# EAGLE design drandyhaas logo (EAGLE 9.6.2)
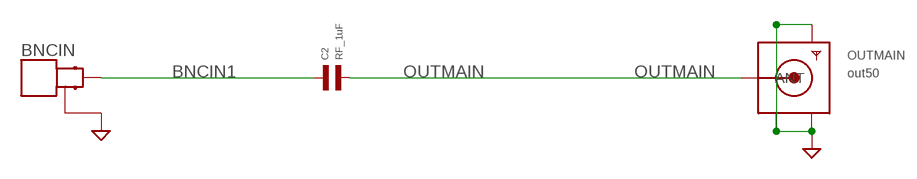
[diagram p0: schematic, sheet 1]

## Parts
BNCIN  MOLEX_BNC_73100-0105  [MOLEX-BNC-73100-0105]
C2  RF_1uF  CAPACITOR_NP_0402  [C0402]
OUTMAIN  out50  SMACONNECTOR_EDGE  [SMA_EDGELAUNCH]

## Nets
BNCIN1: BNCIN.SIGNAL C2.P$1
GND: BNCIN.GND1(GND) BNCIN.GND2(GND) OUTMAIN.GND@1(GND4) OUTMAIN.GND@2(GND3) OUTMAIN.GND@3(GND2) OUTMAIN.GND@4(GND1)
OUTMAIN: C2.P$2 OUTMAIN.P(ANT)

## Library data of the parts
BNCIN = connector:MOLEX_BNC_73100-0105: CONN BNC JACK R/A 50 OHM PCB; DIGIKEY: WM5524-ND; MPN: 73100-0105
C2 = MF_Passives:CAPACITOR_NP: Library: MF_Passives Description: Device for Non-Polarized Capacitors. Manufacture part number (MPN) can be added via Attributes. Check https://factory.macrofab.com/parts for the house parts list.; LCSC: C52923; POPULATE: 1
OUTMAIN = adafruit:SMACONNECTOR: SMA Connector 90° DIP SMA Connector, 50 Ohm (4UConnector: 07259)

## Net classes
0 default: width 0.203 mm
1 power: width 0.152 mm

## Board
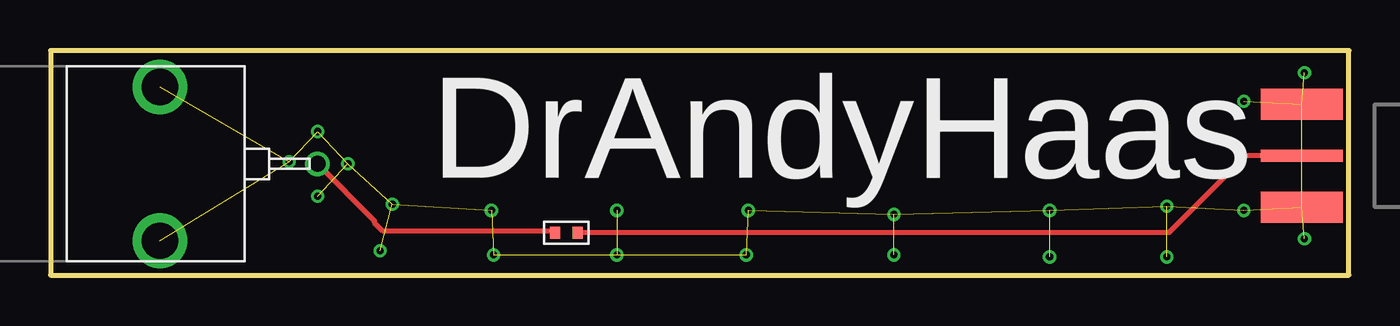
[diagram p1: board, top side]
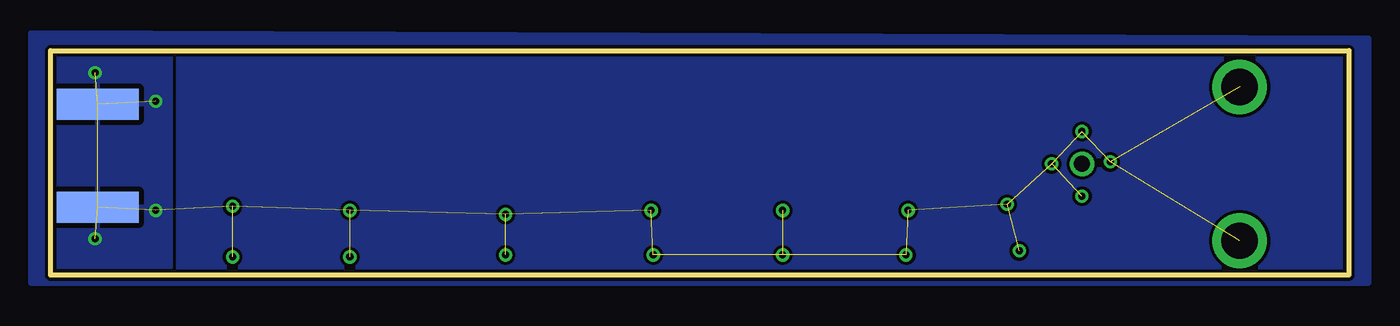
[diagram p2: board, bottom side, seen from below]

Size 64.2 x 11.1 mm. Coordinates in mm from the lower left corner, seen from the top.
Outline: 0,11.1 0,0 64.2,0 64.2,11.1 0,11.1
Copper layers (1*2*15*16): top 0.035mm / dielectric 0.2mm / topgnd 0.0175mm / dielectric 0.3mm / vsmin 0.0175mm / dielectric 0.2mm / vsplus 0.035mm
Design rules "Seeed_AllPCB_MacroFab_haas6mil *": minimum track width 6mil, minimum drill 12mil, track to track 6mil, track to pad 6mil, pad to pad 6mil, via to via 6mil, smd to smd 0mil, copper to edge 6mil, drill to drill 6mil, minimum pad ring 6mil, minimum via ring 6mil, stop-mask expansion 6mil, vias tented up to drill 25mil, thermal gap 10mil

### Footprints (pad centres in the part's own frame; a part is rotated, then mirrored left to right if it is on the bottom)
MOLEX-BNC-73100-0105 = drill 1.8: GND1 -3.8,-3.9; GND2 3.8,-3.9 | drill 0.8: SIGNAL 0,3.9
C0402 = smd 0.5 x 0.6: P$1 -0.55,0; P$2 0.55,0
SMA_EDGELAUNCH = smd 4.064 x 1.524: GND@1 2.032,-2.54; GND@2 2.032,2.54 | smd 4.064 x 1.524 bottom: GND@3 2.032,2.54; GND@4 2.032,-2.54 | smd 4.064 x 0.6: P 2.032,0

### Placement (x,y rotation side)
BNCIN  9.3,5.5 270 top
C2  25.5,2.1 0 top
OUTMAIN  63.9,5.9 180 top

### Tracks (layer width: path | path; a pad name or v marks a point on that pad's centre or on a via)
BNCIN1
  top 0.254: BNCIN.SIGNAL 16,2.7 16,2.6 16.4,2.2 24.85,2.2 C2.P$1
GND  (via drill 0.35)  (27 unrouted)
  other vias: 59,3.2 62,1.8 59,8.6 62,10 11.8,5.6 13.2,7.1 21.9,1 16.3,1.2 13.2,3.9 55.2,3.4 16.9,3.5 55.2,0.9 49.4,0.9 14.7,5.5 49.4,3.2 41.7,1 28,1 21.8,3.2 28,3.2 34.5,3.2 34.4,1 41.7,3
  pour vsplus: 64.6,11.6 64.6,0.4 58.2,0.4 58.2,11.6
OUTMAIN
  top 0.254: OUTMAIN.P 59.1,5.9 55.3,2.1 C2.P$2
VS+
  pour vsplus (isolate 0.152, rank 2): -1,11.7 65.2,11.98 65.2,-0.4 -1,-0.4

### Text on the board
tPlace: DrAndyHaas